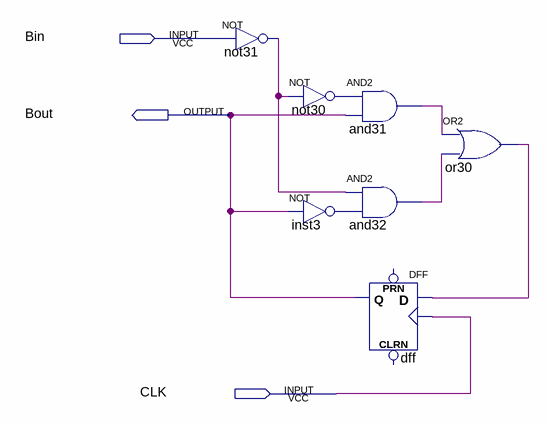
[diagram p0: schematic sheet]
// Quartus schematic setUnsetB.bdf as structural Verilog: 7 symbols, 3 pins
module setUnsetB (
  input  Bin,
  input  CLK,
  output Bout
);

  wire and31_out, and32_out, inst3_out, not30_out, not31_out, or30_out;

  not not31 (not31_out, Bin);
  not not30 (not30_out, not31_out);
  not inst3 (inst3_out, Bout);
  and and31 (and31_out, not30_out, Bout);
  and and32 (and32_out, not31_out, inst3_out);
  DFF dff (.CLK(CLK), .D(or30_out), .Q(Bout));  // open: CLRN, PRN
  or or30 (or30_out, and31_out, and32_out);
endmodule
